# Altium project 222.PrjPCB
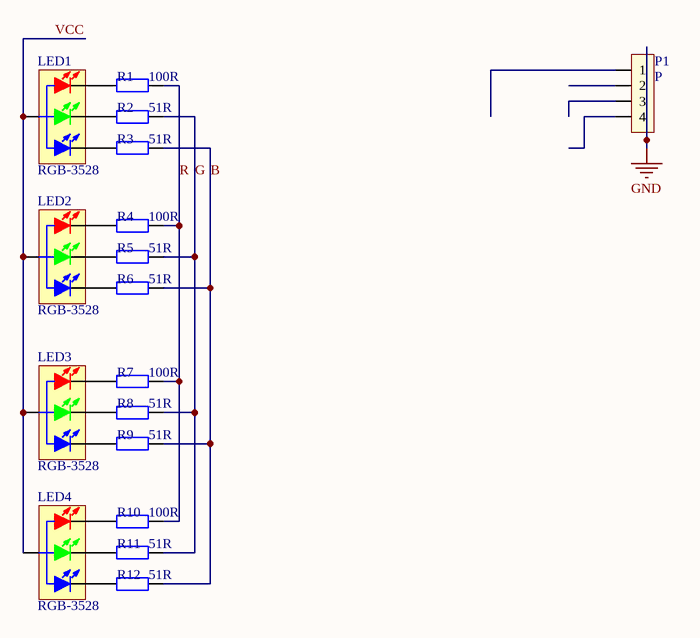
[diagram p0: 222.SchDoc]
1 sheet, 17 parts. Net scope: global (net labels, ports and power ports of the same name join across sheets).
Board file: 222.PcbDoc

## Sheet 222.SchDoc
size A4

### Parts
LED1  RGB-3528  [LED 3528-4Pin]
LED2  RGB-3528  [LED 3528-4Pin]
LED3  RGB-3528  [LED 3528-4Pin]
LED4  RGB-3528  [LED 3528-4Pin]
P1  P  [SH1.0_4pin]
R1  value 100R  [0603-1]  (hidden comment: Res1)
R2  value 51R  [0603-1]  (hidden comment: Res1)
R3  value 51R  [0603-1]  (hidden comment: Res1)
R4  value 100R  [0603-1]  (hidden comment: Res1)
R5  value 51R  [0603-1]  (hidden comment: Res1)
R6  value 51R  [0603-1]  (hidden comment: Res1)
R7  value 100R  [0603-1]  (hidden comment: Res1)
R8  value 51R  [0603-1]  (hidden comment: Res1)
R9  value 51R  [0603-1]  (hidden comment: Res1)
R10  value 100R  [0603-1]  (hidden comment: Res1)
R11  value 51R  [0603-1]  (hidden comment: Res1)
R12  value 51R  [0603-1]  (hidden comment: Res1)

### Nets
GND: P1.0
B: R3.2 R6.2 R9.2 R12.2
G: R2.2 R5.2 R8.2 R11.2
R: R1.2 R4.2 R7.2 R10.2
VCC: LED1.4(A) LED2.4(A) LED3.4(A) LED4.4(A)
NetLED1_1: LED1.1(RED_K) R1.1
NetLED1_2: LED1.2(GREEN_K) R2.1
NetLED1_3: LED1.3(BULE_K) R3.1
NetLED2_1: LED2.1(RED_K) R4.1
NetLED2_2: LED2.2(GREEN_K) R5.1
NetLED2_3: LED2.3(BULE_K) R6.1
NetLED3_1: LED3.1(RED_K) R7.1
NetLED3_2: LED3.2(GREEN_K) R8.1
NetLED3_3: LED3.3(BULE_K) R9.1
NetLED4_1: LED4.1(RED_K) R10.1
NetLED4_2: LED4.2(GREEN_K) R11.1
NetLED4_3: LED4.3(BULE_K) R12.1

Not connected (* = marked no-connect by the designer): P1 1 2 3 4

### Library data of the parts
LED1-LED4 = LED-RGB-3528: 三基色LED; 版权归属: 源创客; BOM名称: 三基色LED; 学习资源: www.ooocke.com
P1 = SH1.0-4
R1-R12 = Res1: 贴片电阻; Published: 8-Jun-2000; LatestRevisionDate: 17-Jul-2002; LatestRevisionNote: Re-released for DXP Platform.; PackageReference: AXIAL-0.4; Publisher: Altium Limited